# EAGLE schematic board_1 (EAGLE 5.11)

## Sheet 1 of 2
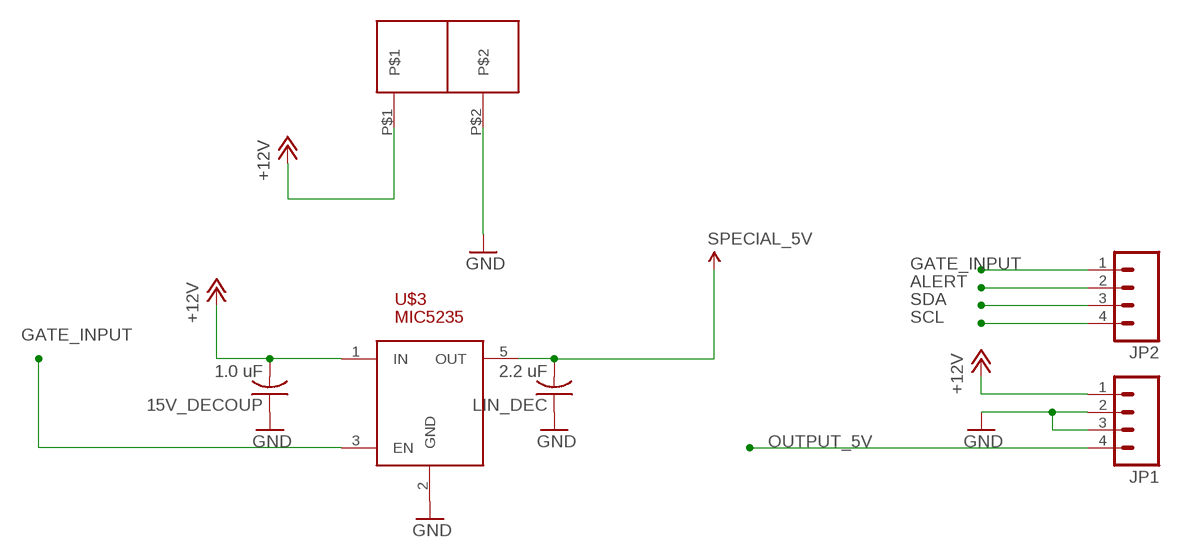
[diagram p0: schematic, sheet 1]

### Parts
15V_DECOUP  1.0 uF  C-USC0603K  [C0603K]
JP1  M04PTH  [1X04]
JP2  M04PTH  [1X04]
LIN_DEC  2.2 uF  C-USC0603K  [C0603K]
U$1  PLUG_TERM_2  [TERM_BLOCK_2]
U$3  MIC5235  [SOT23-5]

### Nets
+12V: 15V_DECOUP.2 JP1.1 U$1.P$1 U$3.1(IN) ; also sheet 2
ALERT: JP2.2 ; also sheet 2
GATE_INPUT: JP2.1 U$3.3(EN) ; also sheet 2
GND: 15V_DECOUP.1 JP1.2 JP1.3 LIN_DEC.1 U$1.P$2 U$3.2(GND) ; also sheet 2
OUTPUT_5V: JP1.4 ; also sheet 2
SCL: JP2.4 ; also sheet 2
SDA: JP2.3 ; also sheet 2
VCC: LIN_DEC.2 U$3.5(OUT) ; supply symbol labelled SPECIAL_5V ; also sheet 2

## Sheet 2 of 2
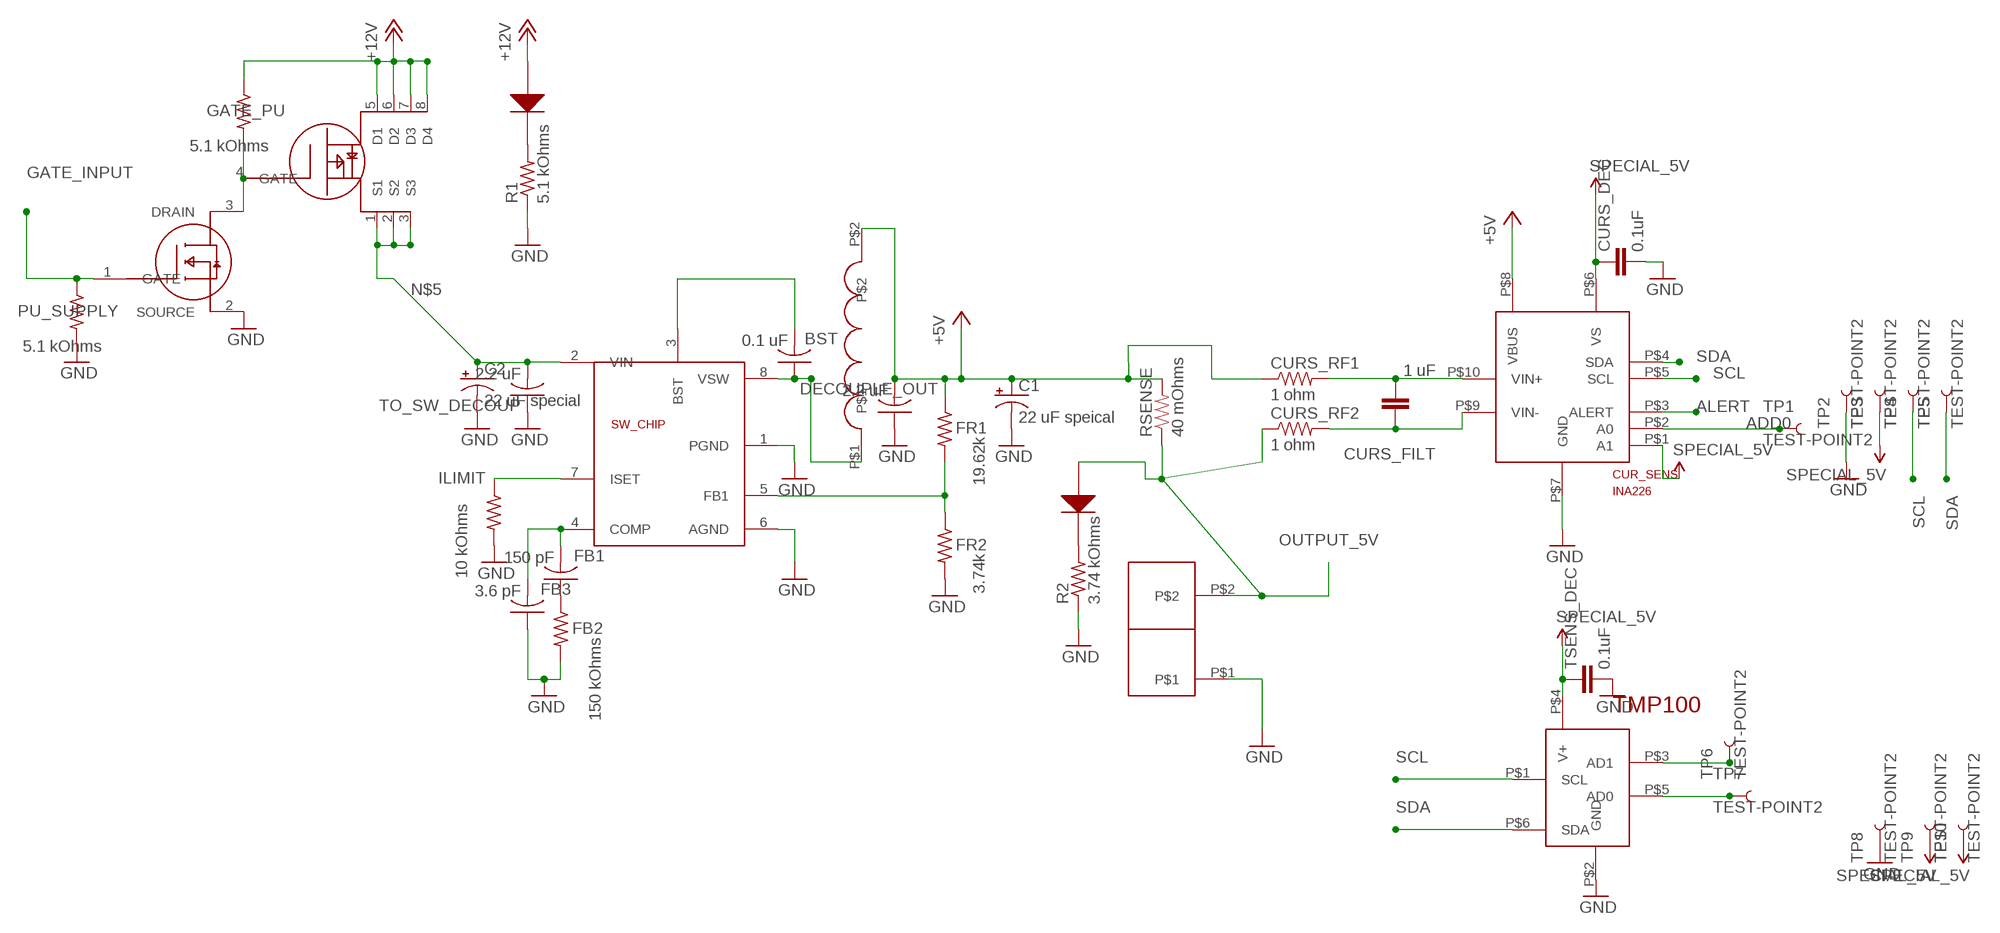
[diagram p1: schematic, sheet 2]

### Parts
BST  0.1 uF  C-USC0603K  [C0603K]
C1  22 uF speical  CAP_POLPTH2  [CPOL-RADIAL-10UF-25V]
C2  22 uF special  CAP_POLPTH2  [CPOL-RADIAL-10UF-25V]
CUR_SENS  INA226  [PSOP-10]
CURS_DEC  0.1uF  CAP0603-CAP  [0603-CAP]
CURS_FILT  1 uF  CAP0603-CAP  [0603-CAP]
CURS_RF1  1 ohm  RESISTOR0603-RES  [0603-RES]
CURS_RF2  1 ohm  RESISTOR0603-RES  [0603-RES]
DECOUPLE_OUT  2.2 uF  C-USC0603K  [C0603K]
FB1  150 pF  C-USC0603K  [C0603K]
FB2  150 kOhms  R-US_R0805  [R0805]
FB3  3.6 pF  C-USC0603K  [C0603K]
FR1  19.62k  R-US_R0805  [R0805]
FR2  3.74k  R-US_R0805  [R0805]
GATE_PU  5.1 kOhms  R-US_R0805  [R0805]
ILIMIT  10 kOhms  R-US_R0805  [R0805]
PU_SUPPLY  5.1 kOhms  R-US_R0805  [R0805]
R1  5.1 kOhms  R-US_R0805  [R0805]
R2  3.74 kOhms  R-US_R0805  [R0805]
RSENSE  40 mOhms  RESISTOR1206  [1206]
SW_CHIP  NCP3155  [SOIC8]
SW_IN  LED  [D0805]
SW_OUT  LED  [D0805]
TO_SW_DECOUP  2.2 uF  C-USC0603K  [C0603K]
TP1  TEST-POINT2  [PAD.02X.02]
TP2  TEST-POINT2  [PAD.02X.02]
TP3  TEST-POINT2  [PAD.02X.02]
TP4  TEST-POINT2  [PAD.02X.02]
TP5  TEST-POINT2  [PAD.02X.02]
TP6  TEST-POINT2  [PAD.02X.02]
TP7  TEST-POINT2  [PAD.02X.02]
TP8  TEST-POINT2  [PAD.02X.02]
TP9  TEST-POINT2  [PAD.02X.02]
TP10  TEST-POINT2  [PAD.02X.02]
TSENS_DEC  0.1uF  CAP0603-CAP  [0603-CAP]
U$2  NR10050  [NR10050]
U$4  IRFML8244  [SOT23]
U$5  PLUG_TERM_2  [TERM_BLOCK_2]
U$6  TMP100  [PSOP-6]
U$7  IRF9317  [SOIC8]

### Nets
+5V: C1.1(+) CUR_SENS.P$8(VBUS) CURS_RF1.1 DECOUPLE_OUT.2 FR1.1 RSENSE.2 U$2.P$2
+12V: GATE_PU.1 SW_IN.1 U$7.5(D1) U$7.6(D2) U$7.7(D3) U$7.8(D4) ; also sheet 1
ADD0: CUR_SENS.P$2(A0) TP1.P$1
ALERT: CUR_SENS.P$3(ALERT) ; also sheet 1
GATE_INPUT: PU_SUPPLY.1 U$4.1(GATE) ; also sheet 1
GND: C1.2(-) C2.2(-) CUR_SENS.P$7(GND) CURS_DEC.2 DECOUPLE_OUT.1 FB2.2 FB3.1 FR2.2 ILIMIT.2 PU_SUPPLY.2 R1.1 R2.1 SW_CHIP.1(PGND) SW_CHIP.6(AGND) TO_SW_DECOUP.1 TP2.P$1 TP8.P$1 TSENS_DEC.2 U$4.2(SOURCE) U$5.P$1 U$6.P$2(GND) ; also sheet 1
N$1: FR1.2 FR2.1 SW_CHIP.5(FB1)
N$2: R1.2 SW_IN.2
N$3: CUR_SENS.P$10(VIN+) CURS_FILT.2 CURS_RF1.2
N$4: CUR_SENS.P$9(VIN-) CURS_FILT.1 CURS_RF2.2
N$5: C2.1(+) SW_CHIP.2(VIN) TO_SW_DECOUP.2 U$7.1(S1) U$7.2(S2) U$7.3(S3)
N$6: R2.2 SW_OUT.2
N$14: BST.1 SW_CHIP.8(VSW) U$2.P$1
N$15: BST.2 SW_CHIP.3(BST)
N$16: ILIMIT.1 SW_CHIP.7(ISET)
N$17: FB1.1 FB2.1
N$18: FB1.2 FB3.2 SW_CHIP.4(COMP)
N$27: GATE_PU.2 U$4.3(DRAIN) U$7.4(GATE)
OUTPUT_5V: CURS_RF2.1 RSENSE.1 SW_OUT.1 U$5.P$2 ; also sheet 1
SCL: CUR_SENS.P$5(SCL) TP4.P$1 U$6.P$1(SCL) ; also sheet 1
SDA: CUR_SENS.P$4(SDA) TP5.P$1 U$6.P$6(SDA) ; also sheet 1
T_AD0: TP7.P$1 U$6.P$5(AD0)
T_AD1: TP6.P$1 U$6.P$3(AD1)
VCC: CUR_SENS.P$1(A1) CUR_SENS.P$6(VS) CURS_DEC.1 TP3.P$1 TP9.P$1 TP10.P$1 TSENS_DEC.1 U$6.P$4(V+) ; supply symbol labelled SPECIAL_5V ; also sheet 1

## Library data of the parts
15V_DECOUP BST DECOUPLE_OUT FB1 FB3 LIN_DEC TO_SW_DECOUP = resistor:C-US: CAPACITOR, American symbol
C1 C2 = SparkFun:CAP_POL: Capacitor Polarized These are standard SMD and PTH capacitors. Normally 10uF, 47uF, and 100uF in electrolytic and tantalum varieties. Always verify the external diameter of the through hole cap, it varies with capacity, voltage, and manufacturer. The EIA devices should be standard.
CUR_SENS = chlk_bot:INA226
CURS_DEC CURS_FILT TSENS_DEC = SparkFun:CAP: Capacitor Standard 0603 ceramic capacitor, and 0.1" leaded capacitor.
CURS_RF1 CURS_RF2 RSENSE = SparkFun:RESISTOR: Resistor Basic schematic elements and footprints for 0603, 1206, and PTH resistors.
FB2 FR1 FR2 GATE_PU ILIMIT PU_SUPPLY = resistor:R-US_: RESISTOR, American symbol
JP1 JP2 = SparkFun:M04: Header 4 Standard 4-pin 0.1" header. Use with straight break away headers (SKU : PRT-00116), right angle break away headers (PRT-00553), swiss pins (PRT-00743), machine pins (PRT-00117), and female headers (PRT-00115). Molex polarized connector foot print use with SKU : PRT-08231 with associated crimp pins and housings. 1MM SMD Version SKU: PRT-10208
R1 R2 = rcl:R-US_: RESISTOR, American symbol
SW_CHIP = chlk_bot:NCP3155
SW_IN SW_OUT = ipad_thingy:LED
TP1-TP10 = SparkFun:TEST-POINT
U$1 U$5 = chlk_bot:PLUG_TERM_2
U$2 = chlk_bot:NR10050
U$3 = chlk_bot:MIC5235
U$4 = chlk_bot:IRFML8244
U$6 = chlk_bot:TMP100
U$7 = chlk_bot:IRF9317